# Altium schematic sheet Deel_4_op_amp.SchDoc: Soldeerstation
size A4; DrawnBy: Kenneth Rennen; Revision: 1.0; SheetNumber: 4; SheetTotal: 5; Number: PXL_1EAI_12102667; Sheet of: 4/5
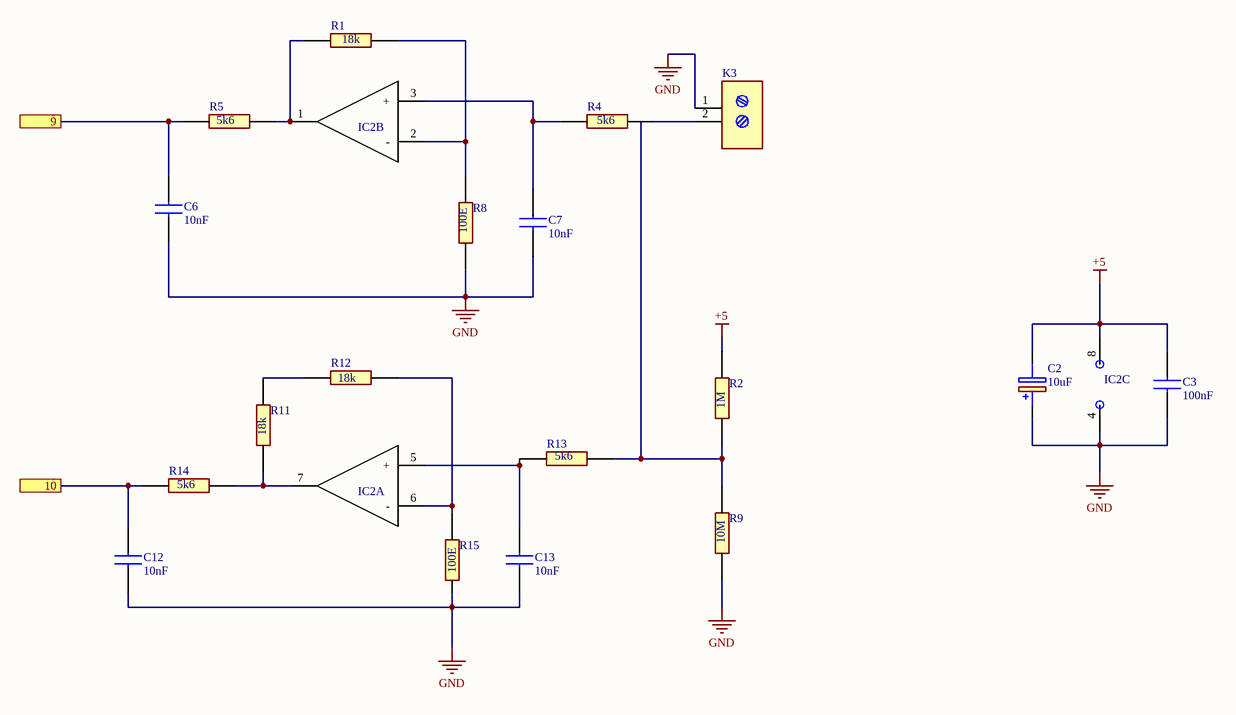
[diagram p0: Deel_4_op_amp.SchDoc]

## Parts
C2  10uF  [10uf]
C3  100nF  [100nF]
C6  10nF  [10nF]
C7  10nF  [10nF]
C12  10nF  [10nF]
C13  10nF  [10nF]
IC2  MCP6002-E_P dual opamp  [mcp6002]  (value not drawn)  (parts A,B,C of 3)
K3  schroefconnector  [schroefconnector]  (value not drawn)
R1  18k  [18k]
R2  1M  [1M]
R4  5k6  [5k6]
R5  5k6  [5k6]
R8  100E  [100ohm]
R9  10M  [10M]
R11  18k  [18k]
R12  18k  [18k]
R13  5k6  [5k6]
R14  5k6  [5k6]
R15  100E  [100ohm]

## Ports
9, 10

## Nets
+5: C2.2(-) C3.2 R2.2
GND: C2.1(+) C3.1 C6.1 C7.1 C12.1 C13.1 K3.1 R8.1 R9.1 R15.1
9: C6.2 R5.1 ; port 9
10: C12.2 R14.1 ; port 10
NetC7_2: C7.2 IC2.3(+) R4.1
NetC13_2: C13.2 IC2.5(+) R13.1
NetIC2_1: IC2.1(VOUTA) R1.1 R5.2
NetIC2_2: IC2.2(-) R1.2 R8.2
NetIC2_6: IC2.6(-) R12.2 R15.2
NetIC2_7: IC2.7(VOUTB) R11.1 R14.2
NetK3_2: K3.2 R4.2
NetR2_1: R2.1 R9.2 R13.2
NetR11_2: R11.2 R12.1

Not connected (* = marked no-connect by the designer): IC2 4(VSS) 8(VDD)

## Library data of the parts
C2 = 10uF: Capacitor Polarised 860020672010; Manufacturer_Name: Wurth Elektronik; Datasheet Link: https://componentsearchengine.com//860020672010.pdf; Height: 12.5mm; Mouser2 Part Number: 710-860020672010; Mouser2 Price/Stock: https://www.mouser.com/Search/Refine.aspx?Keyword=710-860020672010; Manufacturer_Part_Number: 860020672010
C3 = 100nF: Capacitor; Manufacturer_Name: AVX; Manufacturer_Part_Number: 0402YC104MAT2A; Datasheet Link: http://www.mouser.com/catalog/supplier/library/pdf/AVXSurfaceMountCeramic.pdf; Height: 0.56mm; Mouser Part Number: 581-0402YC104MAT2A; Mouser Price/Stock: https://www.mouser.co.uk/ProductDetail/AVX/0402YC104MAT2A?qs=O2%2FeDh0sX9yiCaLwpXy1bw%3D%3D
C6 C7 C12 C13 = 10nF: Capacitor; Manufacturer_Name: AVX; Manufacturer_Part_Number: 0402YC104MAT2A; Datasheet Link: http://www.mouser.com/catalog/supplier/library/pdf/AVXSurfaceMountCeramic.pdf; Height: 0.56mm; Mouser Part Number: 581-0402YC104MAT2A; Mouser Price/Stock: https://www.mouser.co.uk/ProductDetail/AVX/0402YC104MAT2A?qs=O2%2FeDh0sX9yiCaLwpXy1bw%3D%3D
IC2 = MCP6002-E_P dual opamp: Integrated Circuit; Manufacturer_Name: Microchip; Manufacturer_Part_Number: MCP6002-E/P; Datasheet Link: https://componentsearchengine.com//MCP6002-E_P.pdf; Height: 5.334mm; Mouser2 Part Number: 579-MCP6002-E/P; Mouser2 Price/Stock: https://www.mouser.com/Search/Refine.aspx?Keyword=579-MCP6002-E%2FP
K3 = schroefconnector: Connector 1716020000; Manufacturer_Name: Weidmuller; Datasheet Link: https://catalog.weidmueller.com/catalog/Start.do?ObjectID=1716020000&_ga=2.21797499.1716783809.1613378202-511725545.1613378202; Manufacturer_Part_Number: 1716020000
R1 R11 R12 = 18k: Resistor; Manufacturer_Name: TE Connectivity; Manufacturer_Part_Number: CPF0805B100RE1; Datasheet Link: https://datasheet.datasheetarchive.com/originals/distributors/DKDS-21/401696.pdf; Height: 0.65mm; Mouser Part Number: 279-CPF0805B100RE1; Mouser Price/Stock: https://www.mouser.co.uk/ProductDetail/TE-Connectivity-Holsworthy/CPF0805B100RE1?qs=9ylKvqdyudkCWLPT1QvLZQ%3D%3D; Arrow Part Number: CPF0805B100RE1; Arrow Price/Stock: https://www.arrow.com/en/products/cpf0805b100re1/te-connectivity?region=nac
R2 = 1M: Resistor; Manufacturer_Name: TE Connectivity; Manufacturer_Part_Number: CPF0805B100RE1; Datasheet Link: https://datasheet.datasheetarchive.com/originals/distributors/DKDS-21/401696.pdf; Height: 0.65mm; Mouser Part Number: 279-CPF0805B100RE1; Mouser Price/Stock: https://www.mouser.co.uk/ProductDetail/TE-Connectivity-Holsworthy/CPF0805B100RE1?qs=9ylKvqdyudkCWLPT1QvLZQ%3D%3D; Arrow Part Number: CPF0805B100RE1; Arrow Price/Stock: https://www.arrow.com/en/products/cpf0805b100re1/te-connectivity?region=nac
R4 R5 R13 R14 = 5k6: Resistor; Manufacturer_Name: TE Connectivity; Manufacturer_Part_Number: CPF0805B100RE1; Datasheet Link: https://datasheet.datasheetarchive.com/originals/distributors/DKDS-21/401696.pdf; Height: 0.65mm; Mouser Part Number: 279-CPF0805B100RE1; Mouser Price/Stock: https://www.mouser.co.uk/ProductDetail/TE-Connectivity-Holsworthy/CPF0805B100RE1?qs=9ylKvqdyudkCWLPT1QvLZQ%3D%3D; Arrow Part Number: CPF0805B100RE1; Arrow Price/Stock: https://www.arrow.com/en/products/cpf0805b100re1/te-connectivity?region=nac
R8 R15 = 100ohm: Resistor; Manufacturer_Name: TE Connectivity; Manufacturer_Part_Number: CPF0805B100RE1; Datasheet Link: https://datasheet.datasheetarchive.com/originals/distributors/DKDS-21/401696.pdf; Height: 0.65mm; Mouser Part Number: 279-CPF0805B100RE1; Mouser Price/Stock: https://www.mouser.co.uk/ProductDetail/TE-Connectivity-Holsworthy/CPF0805B100RE1?qs=9ylKvqdyudkCWLPT1QvLZQ%3D%3D; Arrow Part Number: CPF0805B100RE1; Arrow Price/Stock: https://www.arrow.com/en/products/cpf0805b100re1/te-connectivity?region=nac
R9 = 10M: Resistor; Manufacturer_Name: TE Connectivity; Manufacturer_Part_Number: CPF0805B100RE1; Datasheet Link: https://datasheet.datasheetarchive.com/originals/distributors/DKDS-21/401696.pdf; Height: 0.65mm; Mouser Part Number: 279-CPF0805B100RE1; Mouser Price/Stock: https://www.mouser.co.uk/ProductDetail/TE-Connectivity-Holsworthy/CPF0805B100RE1?qs=9ylKvqdyudkCWLPT1QvLZQ%3D%3D; Arrow Part Number: CPF0805B100RE1; Arrow Price/Stock: https://www.arrow.com/en/products/cpf0805b100re1/te-connectivity?region=nac